# EAGLE design attiny tsop adapter (EAGLE 6.1)
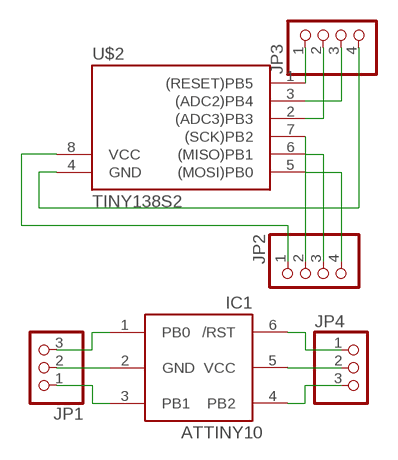
[diagram p0: schematic, sheet 1]

## Parts
IC1  ATTINY10  [SOT23-6]
JP1  PINHD-1X3  [1X03]
JP2  PINHD-1X4  [1X04]
JP3  PINHD-1X4  [1X04]
JP4  PINHD-1X3  [1X03]
U$2  TINY138S2  [SO08]

## Nets
1: IC1.4(PB2) JP4.3
2: IC1.5(VCC) JP4.2
3: IC1.6(/RST) JP4.1
4: IC1.1(PB0) JP1.3
5: IC1.2(GND) JP1.2
6: IC1.3(PB1) JP1.1
N$1: JP3.1 U$2.1((RESET)PB5)
N$2: JP3.2 U$2.2((ADC3)PB3)
N$3: JP3.3 U$2.3((ADC2)PB4)
N$4: JP3.4 U$2.4(GND)
N$5: JP2.4 U$2.5((MOSI)PB0)
N$6: JP2.3 U$2.6((MISO)PB1)
N$7: JP2.2 U$2.7((SCK)PB2)
N$8: JP2.1 U$2.8(VCC)

## Library data of the parts
IC1 = adafruit:ATTINY10: ATtiny4/5/9/10 8-bit Microcontroller with 512/1024 Bytes In-System Programmable Flash
JP1 JP4 = pinhead:PINHD-1X3: PIN HEADER
JP2 JP3 = pinhead:PINHD-1X4: PIN HEADER
U$2 = avr-7:TINY13*

## Net classes
0 default: clearance 0.205 mm

## Board
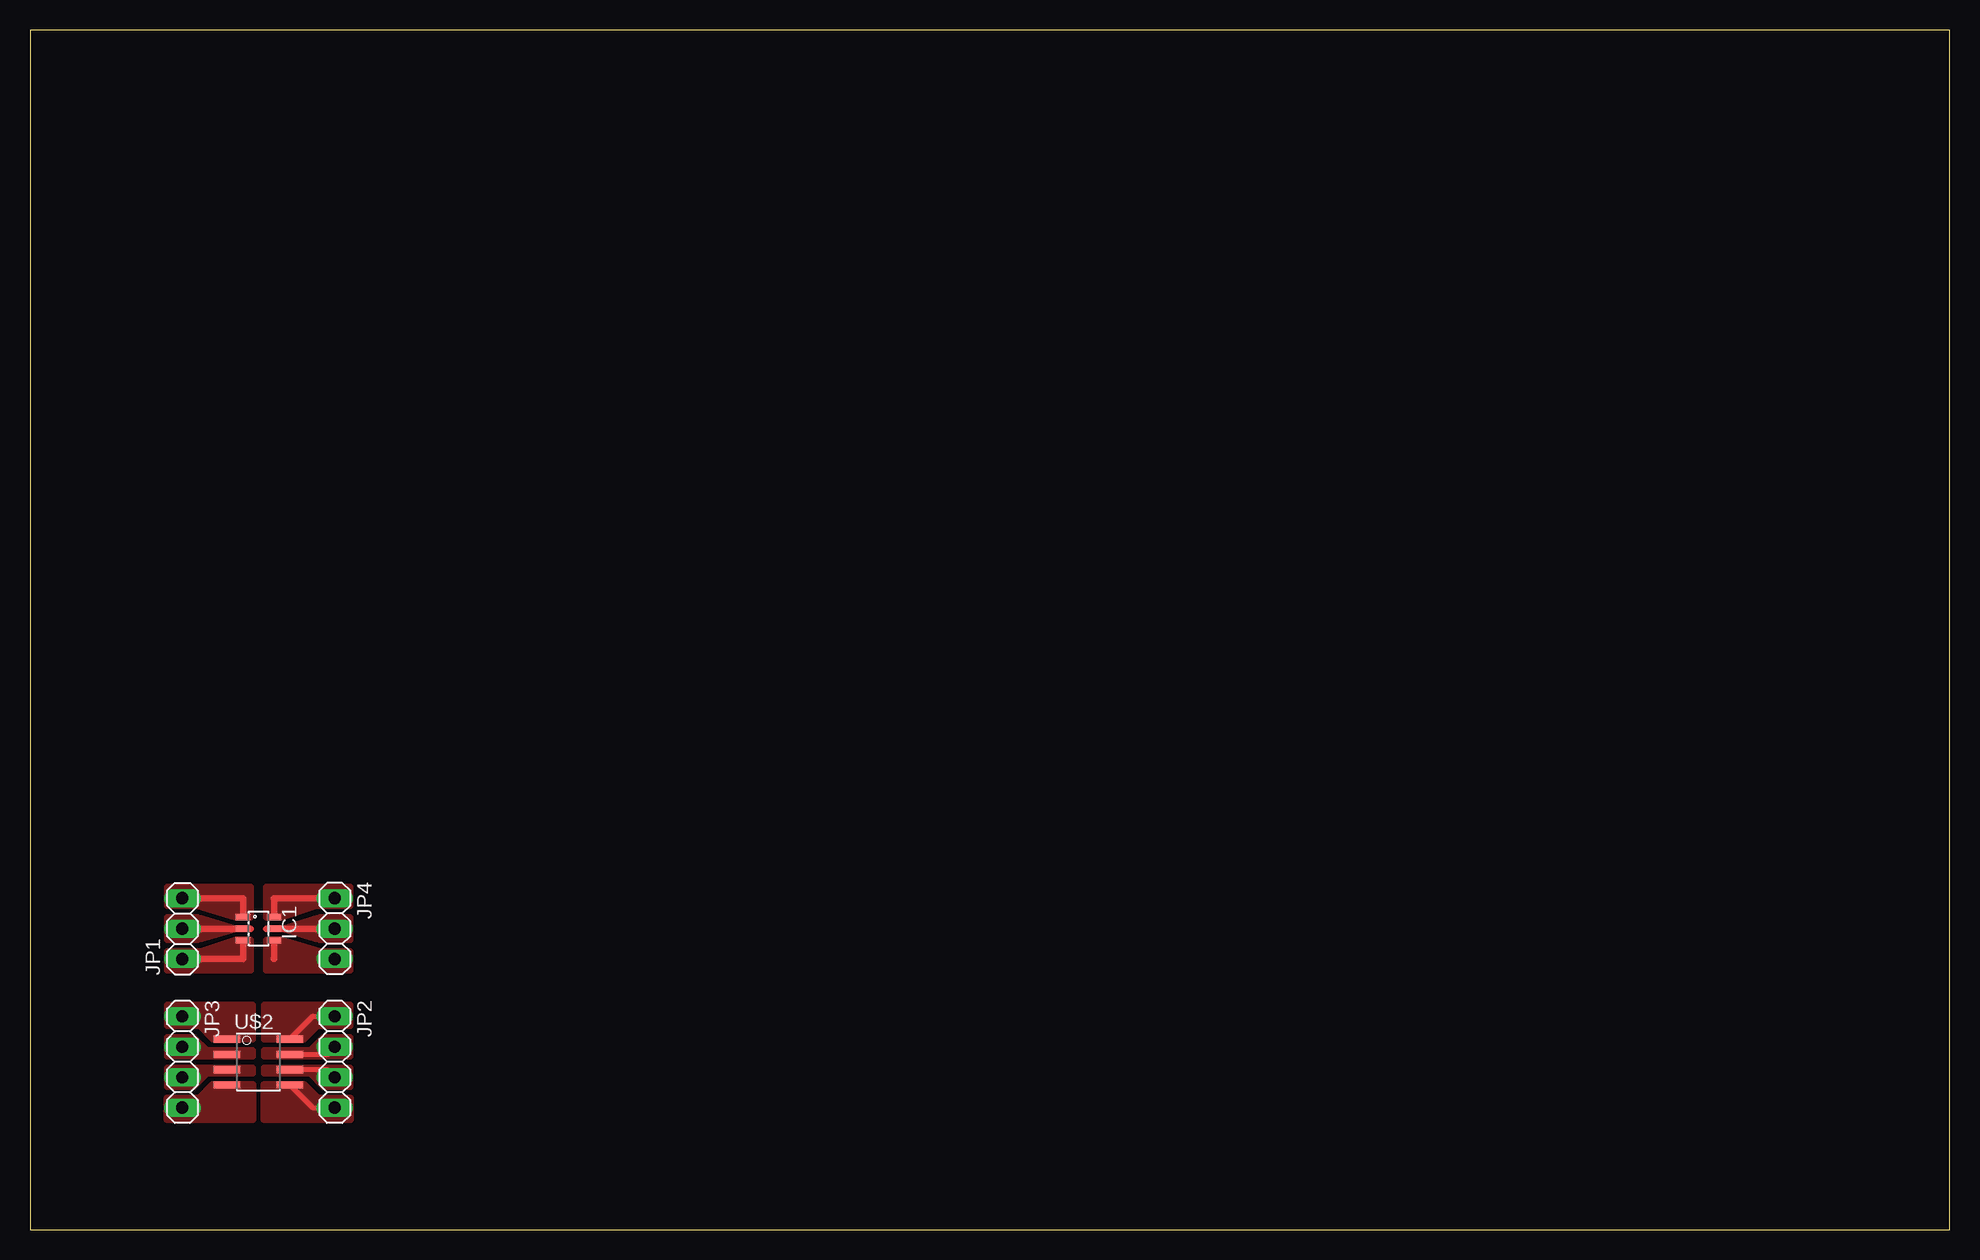
[diagram p1: board, top side]

Size 160 x 100 mm. Coordinates in mm from the lower left corner, seen from the top.
Outline: 0,0 160,0 160,100 0,100 0,0
Copper layers (1*16): Top 0.035mm / dielectric 1.5mm / Bottom 0.035mm
Design rules: minimum track width 10mil, minimum drill 24mil, track to track 8mil, track to pad 8mil, pad to pad 8mil, via to via 8mil, smd to smd 8mil, copper to edge 40mil, drill to drill 8mil, minimum pad ring 10mil, minimum via ring 8mil, stop-mask expansion 4mil, vias tented up to drill 0mil, thermal gap 10mil

### Footprints (pad centres in the part's own frame; a part is rotated, then mirrored left to right if it is on the bottom)
SOT23-6 = smd 0.55 x 1.2: 1 -0.95,-1.3; 2 0,-1.3; 3 0.95,-1.3; 4 0.95,1.3; 5 0,1.3; 6 -0.95,1.3
1X03 = drill 1.016 long: 1 -2.54,0; 2 0,0; 3 2.54,0
1X04 = drill 1.016 long: 1 -3.81,0; 2 -1.27,0; 3 1.27,0; 4 3.81,0
SO08 = smd 0.61 x 2.21: 1 -1.905,-2.616; 2 -0.635,-2.616; 3 0.635,-2.616; 4 1.905,-2.616; 5 1.905,2.616; 6 0.635,2.616; 7 -0.635,2.616; 8 -1.905,2.616

### Placement (x,y rotation side)
IC1  19.05,25.08 270 top
JP1  12.7,25.08 90 top
JP2  25.4,13.97 270 top
JP3  12.7,13.97 270 top
JP4  25.4,25.08 270 top
U$2  19.05,13.97 270 top

### Tracks (layer width: path | path; a pad name or v marks a point on that pad's centre or on a via)
1
  Top 0.559: IC1.4 20.35,22.57 20.32,22.54
  pour Top (isolate 0.254, no thermals): 26.67,23.18 26.67,21.59 19.68,21.59 19.68,24.13 20.95,24.13 24.13,23.18
2
  Top 0.559: IC1.5 JP4.2
  pour Top (isolate 0.254, no thermals): 24.13,24.13 21.11,25.08 24.13,26.04
  pour Top (isolate 0.254, no thermals): 24.13,24.13 26.67,24.13 26.67,26.04 24.13,26.04
3
  Top 0.559: IC1.6 20.35,27.59 20.32,27.62 JP4.1
  pour Top (isolate 0.254, no thermals): 26.67,28.57 19.68,28.57 19.68,26.04 20.95,26.04 23.81,26.99 26.67,26.99
4
  Top 0.559: IC1.1 17.75,27.59 17.78,27.62 JP1.3
  pour Top (isolate 0.254, no thermals): 18.41,26.04 18.41,28.57 11.43,28.57 11.43,26.99 13.97,26.99 17.14,26.04
5
  Top 0.559: JP1.2 IC1.2
  pour Top (isolate 0.254, no thermals): 13.97,24.13 17.14,25.08 13.97,26.04
  pour Top (isolate 0.254, no thermals): 13.97,24.13 11.43,24.13 11.43,26.04 13.97,26.04
6
  Top 0.559: IC1.3 17.75,22.57 17.78,22.54 12.38,22.54 12.7,22.86
  pour Top (isolate 0.254, no thermals): 18.41,21.59 11.43,21.59 11.43,23.18 14.29,23.18 17.14,24.13 18.41,24.13
N$1
  pour Top (no thermals): 11.43,16.99 11.43,18.73 18.57,18.73 18.57,15.88 15.24,15.88 14.13,16.99
N$2
  pour Top (no thermals): 11.43,14.45 18.57,14.45 18.57,14.92 14.76,14.92 13.65,16.03 11.43,16.03
N$3
  pour Top (no thermals): 11.43,11.91 13.65,11.91 14.76,13.02 18.57,13.02 18.57,13.49 11.43,13.49
N$4
  pour Top (no thermals): 11.43,9.21 11.43,10.95 14.13,10.95 15.24,12.06 18.57,12.06 18.57,9.21
N$5
  Top 0.406: U$2.5 23.57,10.16 JP2.4
  pour Top (no thermals): 26.67,9.21 26.67,10.95 23.97,10.95 22.86,12.06 19.53,12.06 19.53,9.21
N$6
  Top 0.406: U$2.6 24.77,13.34 JP2.3
  pour Top (no thermals): 26.67,11.91 24.45,11.91 23.34,13.02 19.53,13.02 19.53,13.49 26.67,13.49
N$7
  Top 0.406: U$2.7 24.92,14.61 25.56,15.24 JP2.2
  pour Top (no thermals): 26.67,14.45 19.53,14.45 19.53,14.92 23.34,14.92 24.45,16.03 26.67,16.03
N$8
  Top 0.406: U$2.8 23.57,17.78 JP2.1
  pour Top (no thermals): 26.67,16.99 26.67,18.73 19.53,18.73 19.53,15.88 22.86,15.88 23.97,16.99
N$9
  Top 0.559: 17.94,25.08 18.41,25.08
N$10
  Top 0.559: 20.32,25.08 19.68,25.08